# EAGLE design momav_servo (EAGLE 9.6.1)
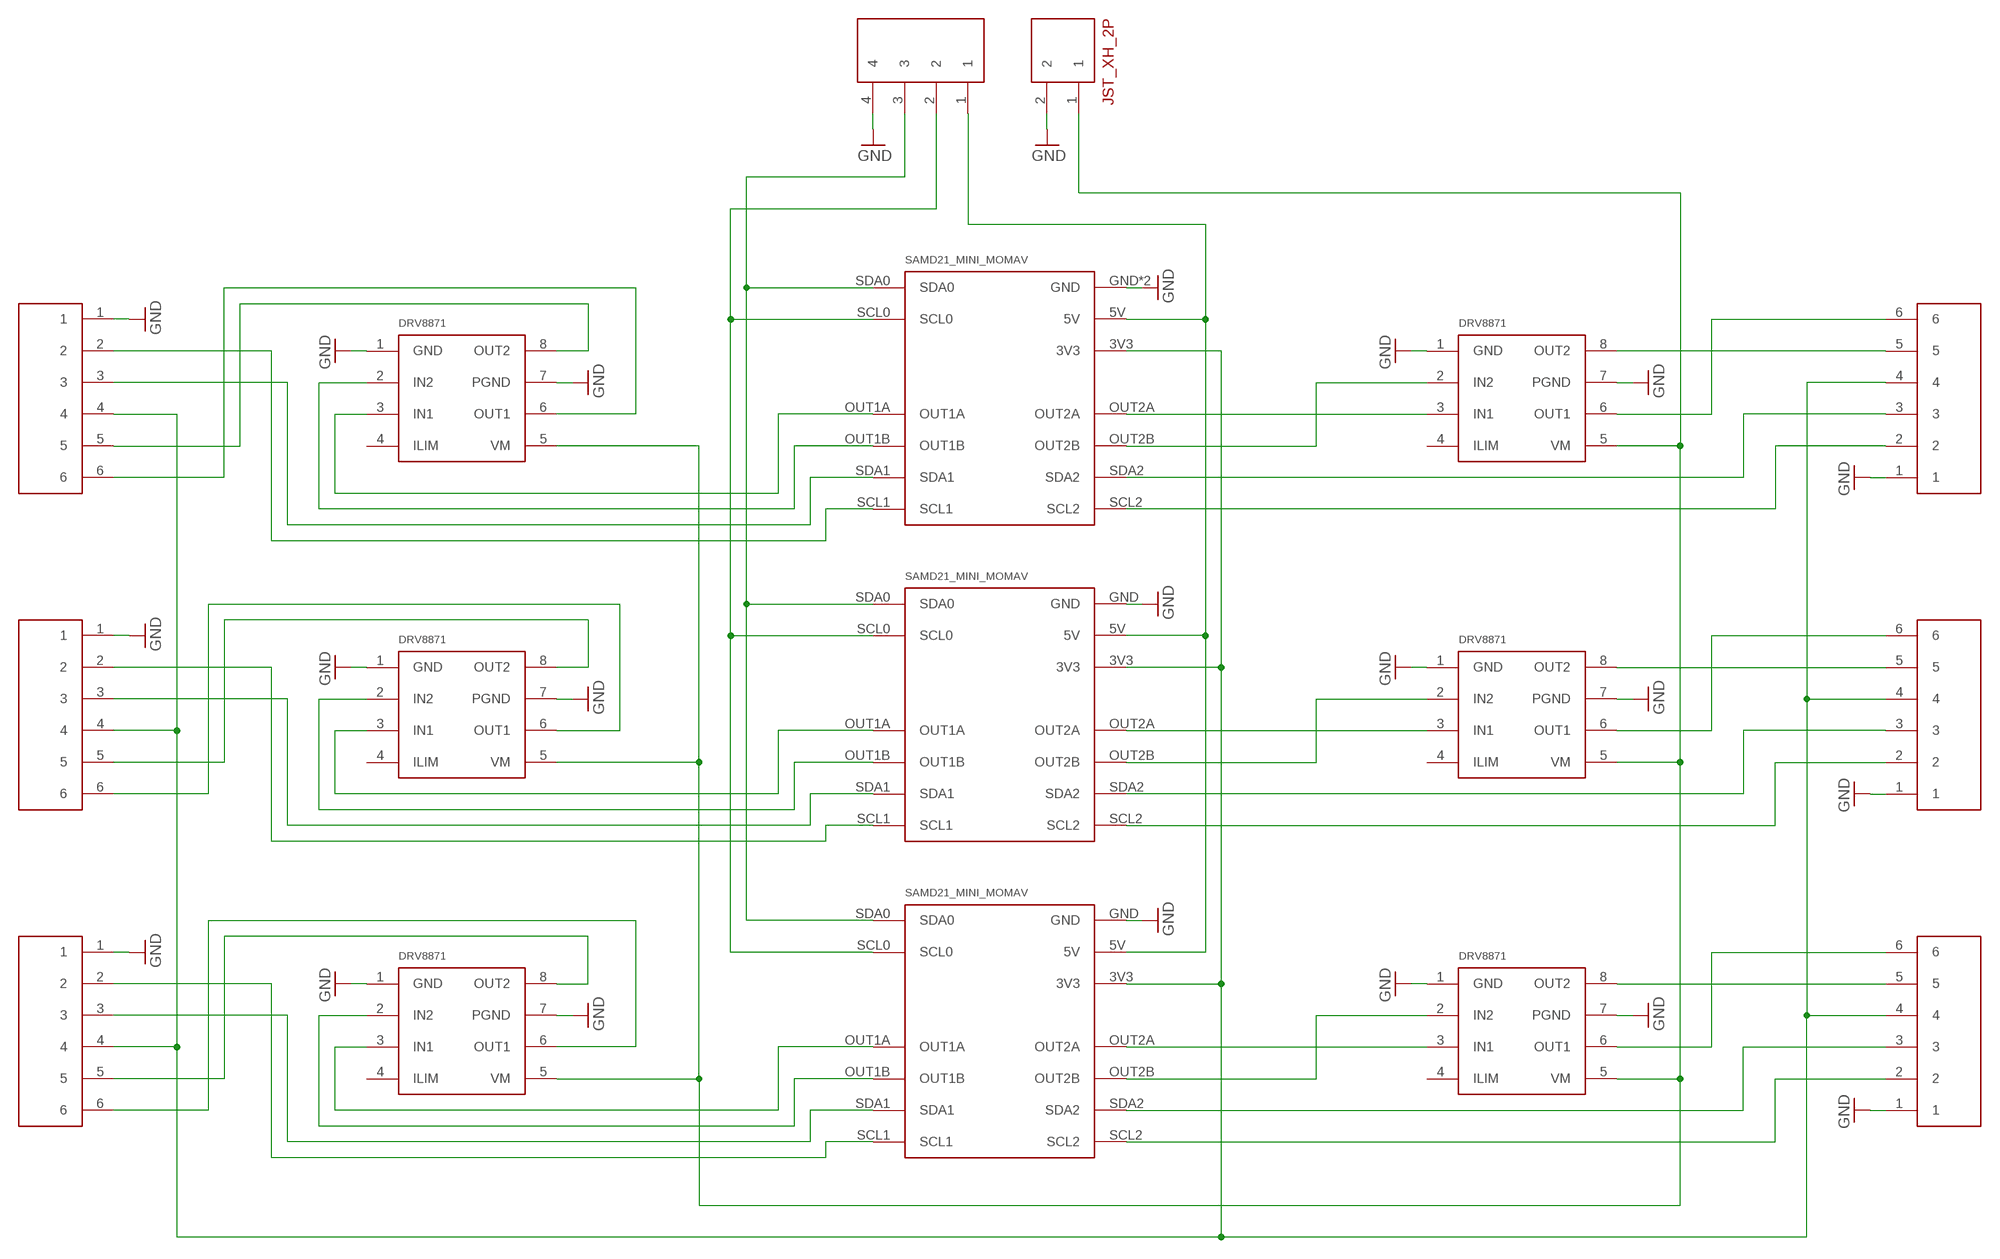
[diagram p0: schematic, sheet 1]

## Parts
U$1  DRV8871BOB  [DRV8871BOB]
U$2  DRV8871BOB  [DRV8871BOB]
U$3  DRV8871BOB  [DRV8871BOB]
U$4  DRV8871BOB  [DRV8871BOB]
U$5  DRV8871BOB  [DRV8871BOB]
U$6  DRV8871BOB  [DRV8871BOB]
U$7  SAMD21_MINI_MOMAV1  [SAMD21_MINI_MOMAV1]
U$8  SAMD21_MINI_MOMAV  [SAMD21_MINI_MOMAV]
U$9  SAMD21_MINI_MOMAV  [SAMD21_MINI_MOMAV]
U$10  JST_XH_2P  [JST_XH_2P]
U$11  JST_ZH_4P  [JST_ZH_4P]
U$12  JST_ZH_6P  [JST_ZH_6P]
U$13  JST_ZH_6P  [JST_ZH_6P]
U$14  JST_ZH_6P  [JST_ZH_6P]
U$15  JST_ZH_6P  [JST_ZH_6P]
U$16  JST_ZH_6P  [JST_ZH_6P]
U$17  JST_ZH_6P  [JST_ZH_6P]

## Nets
GND: U$1.1(GND) U$1.7(PGND) U$2.1(GND) U$2.7(PGND) U$3.1(GND) U$3.7(PGND) U$4.1(GND) U$4.7(PGND) U$5.1(GND) U$5.7(PGND) U$6.1(GND) U$6.7(PGND) U$7.GND U$7.GND2(GND) U$8.GND U$9.GND U$10.2 U$11.4 U$12.1 U$13.1 U$14.1 U$15.1 U$16.1 U$17.1
N$1: U$7.SCL1 U$12.2
N$2: U$1.3(IN1) U$7.OUT1A
N$3: U$1.2(IN2) U$7.OUT1B
N$4: U$2.3(IN1) U$8.OUT1A
N$5: U$2.2(IN2) U$8.OUT1B
N$6: U$3.3(IN1) U$9.OUT1A
N$7: U$3.2(IN2) U$9.OUT1B
N$8: U$4.3(IN1) U$7.OUT2A
N$9: U$7.5V U$8.5V U$9.5V U$11.1
N$10: U$5.3(IN1) U$8.OUT2A
N$11: U$5.2(IN2) U$8.OUT2B
N$12: U$6.3(IN1) U$9.OUT2A
N$13: U$6.2(IN2) U$9.OUT2B
N$14: U$7.SDA0 U$8.SDA0 U$9.SDA0 U$11.3
N$15: U$7.SCL0 U$8.SCL0 U$9.SCL0 U$11.2
N$16: U$4.2(IN2) U$7.OUT2B
N$17: U$9.SCL2 U$15.2
N$18: U$1.5(VM) U$2.5(VM) U$3.5(VM) U$4.5(VM) U$5.5(VM) U$6.5(VM) U$10.1
N$19: U$7.SDA1 U$12.3
N$20: U$8.SDA1 U$13.3
N$21: U$8.SCL1 U$13.2
N$22: U$9.SDA1 U$14.3
N$23: U$9.SCL1 U$14.2
N$24: U$7.3V3 U$8.3V3 U$9.3V3 U$12.4 U$13.4 U$14.4 U$15.4 U$16.4 U$17.4
N$25: U$9.SDA2 U$15.3
N$26: U$8.SCL2 U$16.2
N$27: U$8.SDA2 U$16.3
N$28: U$7.SCL2 U$17.2
N$29: U$7.SDA2 U$17.3
N$30: U$4.6(OUT1) U$17.6
N$31: U$4.8(OUT2) U$17.5
N$32: U$5.8(OUT2) U$16.5
N$33: U$6.6(OUT1) U$15.6
N$34: U$6.8(OUT2) U$15.5
N$36: U$1.8(OUT2) U$12.5
N$37: U$1.6(OUT1) U$12.6
N$38: U$2.8(OUT2) U$13.5
N$39: U$2.6(OUT1) U$13.6
N$40: U$5.6(OUT1) U$16.6
N$41: U$3.6(OUT1) U$14.6
N$42: U$3.8(OUT2) U$14.5
Unconnected: U$1.4(ILIM) U$2.4(ILIM) U$3.4(ILIM) U$4.4(ILIM) U$5.4(ILIM) U$6.4(ILIM)

## Library data of the parts
U$1-U$6 = _custom:DRV8871: DRV8871 H-Bridge Motor driver
U$7 = _custom:SAMD21_MINI_MOMAV1: Sparkfun SAMD21 Mini board for MOMAV project
U$8 U$9 = _custom:SAMD21_MINI_MOMAV: Sparkfun SAMD21 Mini board for MOMAV project
U$10 = _custom:JST_XH_2P
U$11 = _custom:JST_ZH_4P
U$12-U$17 = _custom:JST_ZH_6P

## Board
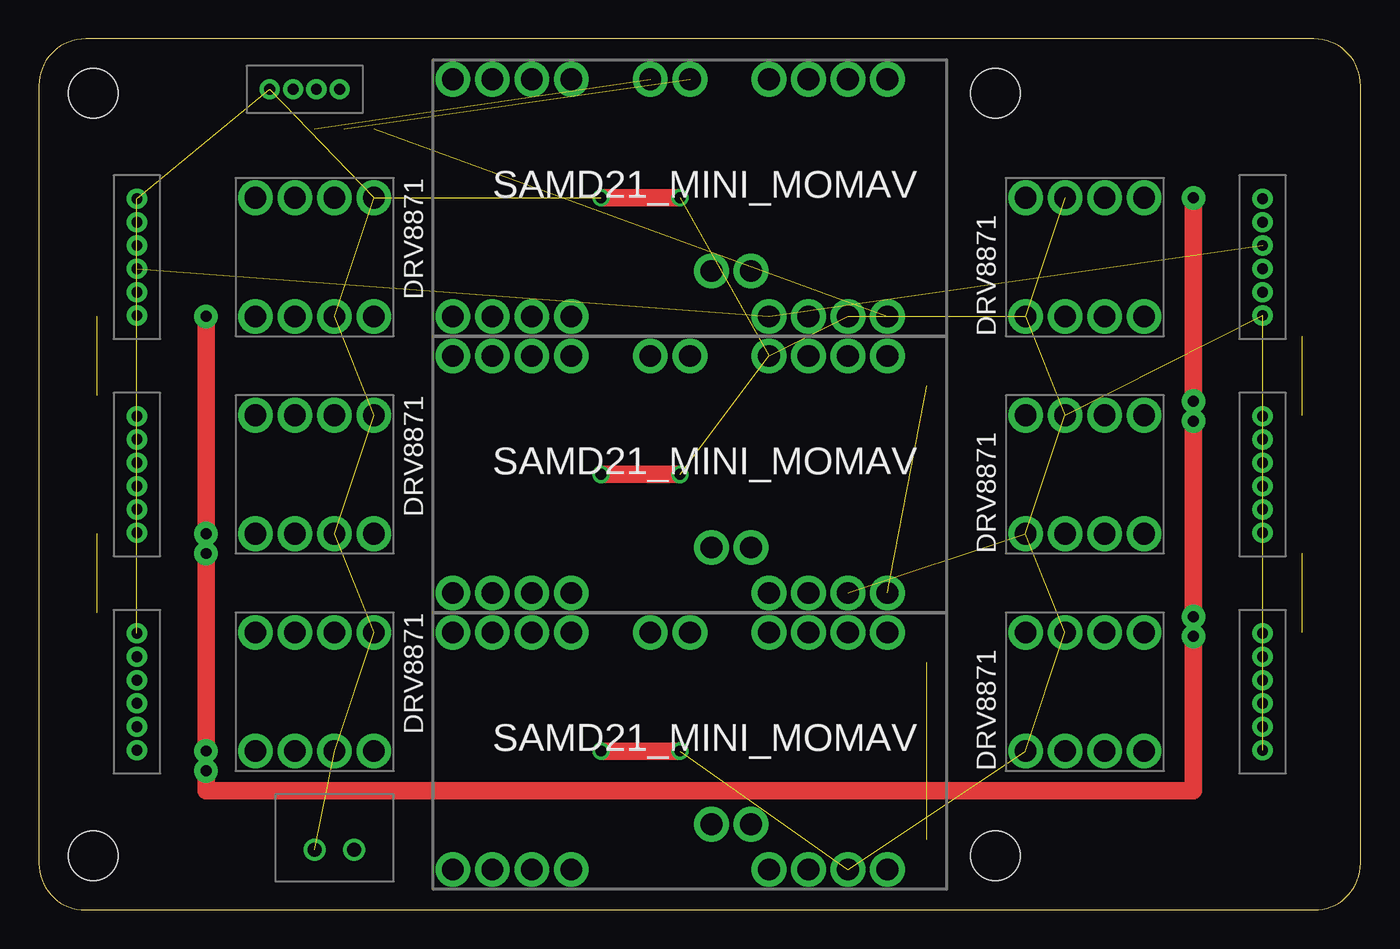
[diagram p1: board, top side]
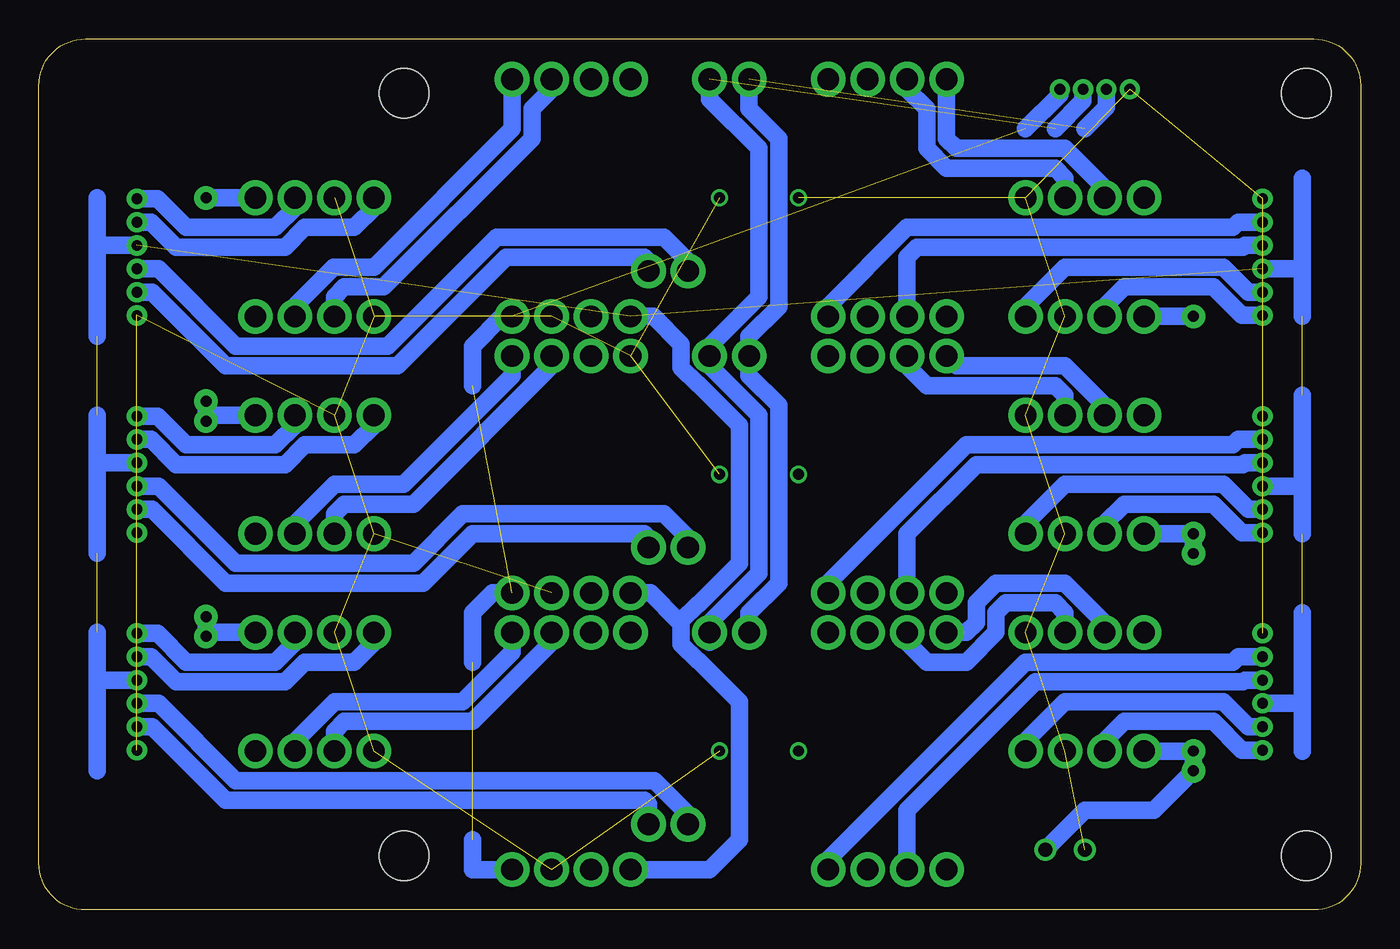
[diagram p2: board, bottom side, seen from below]

Size 85 x 56 mm. Coordinates in mm from the lower left corner, seen from the top.
Outline: 0,53 0,3 arc90 3,0 82,0 arc90 85,3 85,53 arc90 82,56 3,56 arc90 0,53
Copper layers (1*16): Top 0.035mm / dielectric 1.5mm / Bottom 0.035mm
Design rules "default": minimum track width 6mil, minimum drill 0.35mm, track to track 6mil, track to pad 6mil, pad to pad 6mil, via to via 6mil, smd to smd 6mil, copper to edge 40mil, drill to drill 6mil, minimum pad ring 10mil, minimum via ring 8mil, stop-mask expansion 4mil, vias tented up to drill 0mil, thermal gap 10mil
Holes 3.17 mm at 3.5,52.5 61.5,52.5 61.5,3.5 3.5,3.5

### Footprints (pad centres in the part's own frame; a part is rotated, then mirrored left to right if it is on the bottom)
DRV8871BOB = drill 1.4 pad 2.235: 1 -3.81,3.81; 2 -3.81,1.27; 3 -3.81,-1.27; 4 -3.81,-3.81; 5 3.81,-3.81; 6 3.81,-1.27; 7 3.81,1.27; 8 3.81,3.81
SAMD21_MINI_MOMAV1 = drill 1.4 pad 2.235: 3V3 5.08,-7.62; 5V 12.7,-7.62; GND 10.16,-7.62; GND2 5.08,7.62; NC1 -10.16,7.62; NC2 -7.62,7.62; NC3 -15.24,-7.62; NC4 -10.16,-7.62; NC6 7.62,7.62; NC7 7.62,-7.62; OUT1A 12.7,7.62; OUT1B 10.16,7.62; OUT2A -15.24,7.62; OUT2B -12.7,7.62; SCL0 0,7.62; SCL1 3.937,-4.699; SCL2 -7.62,-7.62; SDA0 -2.54,7.62; SDA1 1.397,-4.699; SDA2 -12.7,-7.62
SAMD21_MINI_MOMAV = drill 1.4 pad 2.235: 3V3 5.08,-7.62; 5V 12.7,-7.62; GND 10.16,-7.62; NC1 -10.16,7.62; NC2 -7.62,7.62; NC3 -15.24,-7.62; NC4 -10.16,-7.62; NC5 5.08,7.62; NC6 7.62,7.62; NC7 7.62,-7.62; OUT1A 12.7,7.62; OUT1B 10.16,7.62; OUT2A -15.24,7.62; OUT2B -12.7,7.62; SCL0 0,7.62; SCL1 3.937,-4.699; SCL2 -7.62,-7.62; SDA0 -2.54,7.62; SDA1 1.397,-4.699; SDA2 -12.7,-7.62
JST_XH_2P = drill 0.9: 1 -1.27,0; 2 1.27,0
JST_ZH_4P = drill 0.7 pad 1.295: 1 -2.25,0; 2 -0.75,0; 3 0.75,0; 4 2.25,0
JST_ZH_6P = drill 0.7 pad 1.295: 1 -3.75,0; 2 -2.25,0; 3 -0.75,0; 4 0.75,0; 5 2.25,0; 6 3.75,0

### Placement (x,y rotation side)
U$1  67.26,28 90 top
U$2  67.26,14.03 90 top
U$3  67.26,41.97 90 top
U$4  17.73,28 270 top
U$5  17.73,14.03 270 top
U$6  17.73,41.97 270 top
U$7  41.86,28 0 top
U$8  41.86,10.22 0 top
U$9  41.86,45.78 0 top
U$10  19,3.87 180 top
U$11  17.1,52.76 180 top
U$12  78.69,28 90 top
U$13  78.69,14.03 90 top
U$14  78.69,41.97 90 top
U$15  6.3,41.97 270 top
U$16  6.3,14.03 270 top
U$17  6.3,28 270 top

### Tracks (layer width: path | path; a pad name or v marks a point on that pad's centre or on a via)
GND  (via drill 0.7)  (26 unrouted)
  Top 1.118: v36.15,45.78 v41.23,45.78 | v36.15,28 v41.23,28 | v36.15,10.22 v41.23,10.22
N$1
  Bottom 1.118: U$7.SCL1 45.8,23.94 46.06,24.19 57.1,24.19 60.28,21.01 72.98,21.01 77.71,25.75 U$12.2
N$2
  Bottom 1.118: U$1.3 68.53,24.82 65.99,27.36 61.55,27.36 54.56,34.35 U$7.OUT1A
N$3
  Bottom 1.118: U$1.2 65.99,25.46 65.36,26.09 60.91,26.09 52.02,34.98 U$7.OUT1B
N$4
  Bottom 1.118: U$2.3 68.53,10.85 65.99,13.39 57.74,13.39 54.56,16.57 U$8.OUT1A
N$5
  Bottom 1.118: U$2.2 65.99,11.49 65.36,12.12 57.1,12.12 52.02,17.2 U$8.OUT1B
N$6
  Bottom 1.118: U$3.3 68.53,38.86 66.06,41.33 63.45,41.33 54.56,50.22 U$9.OUT1A
N$7
  Bottom 1.118: U$3.2 65.99,39.43 65.36,40.06 62.82,40.06 53.29,49.59 53.29,51.49 52.02,52.76 U$9.OUT1B
N$8
  Bottom 1.118: U$7.OUT2A 25.99,34.98 19,34.98 16.46,32.44 U$4.3
N$9  (3 unrouted)
  Bottom 1.118: U$8.5V 57.1,2.6 57.1,4.5 | U$9.5V 55.2,38.16 57.1,36.25 57.1,33.71 | U$7.5V 55.83,20.38 57.1,19.11 57.1,15.93 | U$11.1 19.35,52.42 21.54,50.22
N$10
  Bottom 1.118: U$8.OUT2A 25.35,17.84 24.72,18.47 24.72,19.74 23.45,21.01 19,21.01 16.46,18.47 U$5.3
N$11
  Bottom 1.118: U$5.2 19,19.11 19.64,19.74 22.81,19.74 23.45,19.11 23.45,17.84 25.35,15.93 27.89,15.93 29.16,17.2 U$8.OUT2B
N$12
  Bottom 1.118: U$6.3 16.46,46.41 19,48.95 25.99,48.95 26.62,49.59 U$9.OUT2A
N$13
  Bottom 1.118: U$6.2 19,47.05 19.64,47.68 26.62,47.68 27.89,48.95 27.89,51.49 29.16,52.76 U$9.OUT2B
N$14  (1 unrouted)
  Bottom 1.118: U$8.SDA0 39.32,19.11 37.42,21.01 37.42,32.44 39.32,34.35 U$7.SDA0 39.32,36.89 37.42,38.79 37.42,49.59 39.32,51.49 U$9.SDA0 | U$11.3 16.35,51.61 17.73,50.22
N$15  (1 unrouted)
  Bottom 1.118: U$9.SCL0 41.86,52.13 38.69,48.95 38.69,39.43 41.86,36.25 U$7.SCL0 41.86,34.98 38.69,31.81 38.69,21.65 41.86,18.47 U$8.SCL0 41.86,17.2 | U$11.2 17.85,52.01 19.64,50.22
N$16
  Bottom 1.118: U$7.OUT2B 29.16,34.98 27.89,33.71 19.64,33.71 19,33.08 U$4.2
N$17
  Bottom 1.118: U$9.SCL2 34.24,38.79 29.16,43.87 8.21,43.87 7.86,44.22 U$15.2
N$18  (via drill 0.7 pad 1.52)
  Top 1.118: v74.25,18.86 v74.25,31.43 | v74.25,45.78 v74.25,32.7 | v10.75,10.22 v10.75,22.92 | v10.75,24.19 v10.75,38.16 | v10.75,8.95 10.75,7.68 74.25,7.68 v74.25,17.59
  Bottom 1.118: U$2.5 74,17.84 v74.25,17.59 v74.25,18.86 | U$5.5 v10.75,10.22 v10.75,8.95 13.29,6.41 17.73,6.41 U$10.1 | v74.25,32.7 v74.25,31.43 73.87,31.81 U$1.5 | v10.75,22.92 v10.75,24.19 U$4.5 | U$3.5 v74.25,45.78 | U$6.5 v10.75,38.16
N$19
  Bottom 1.118: U$7.SDA1 43.26,23.94 44.79,25.46 57.74,25.46 60.91,22.28 72.34,22.28 77.31,27.25 U$12.3
N$20
  Bottom 1.118: U$13.3 77.31,13.28 72.34,8.31 45.42,8.31 43.26,6.16 U$8.SDA1
N$21
  Bottom 1.118: U$8.SCL1 45.8,6.79 46.06,7.04 72.98,7.04 77.71,11.78 U$13.2
N$22
  Bottom 1.118: U$9.SDA1 43.26,41.72 44.79,43.24 55.58,43.24 62.57,36.25 72.34,36.25 77.31,41.22 U$14.3
N$23
  Bottom 1.118: U$9.SCL1 45.8,41.72 46.06,41.97 54.95,41.97 61.93,34.98 72.98,34.98 77.71,39.72 U$14.2
N$24  (6 unrouted)
  Bottom 1.118: U$8.3V3 41.86,2.6 39.96,4.5 39.96,13.39 42.58,16.01 42.62,16.01 43.69,17.08 43.69,18.6 | U$9.3V3 45.48,38.16 43.69,36.38 43.69,34.86 42.62,33.79 42.58,33.79 39.96,31.17 39.96,22.28 42.58,19.67 42.62,19.67 43.69,18.6 | 43.69,18.6 43.89,18.6 45.67,20.38 U$7.3V3 | U$12.4 81.23,28.75 | 81.23,28.75 81.23,22.92 | 81.23,31.81 81.23,28.75 | 81.23,36.89 81.23,42.72 | U$14.4 81.23,42.72 | 81.23,42.72 81.23,45.78 | U$13.4 81.23,14.78 | 81.23,14.78 81.23,17.84 | 81.23,14.78 81.23,8.95 | U$15.4 3.76,41.22 | 3.76,41.22 3.76,47.05 | 3.76,41.22 3.76,38.16 | U$17.4 3.76,27.25 | 3.76,27.25 3.76,33.08 | 3.76,27.25 3.76,24.19 | U$16.4 3.76,13.28 | 3.76,13.28 3.76,19.11 | 3.76,13.28 3.76,10.22
N$25
  Bottom 1.118: U$9.SDA2 29.16,41.97 28.53,42.6 7.57,42.6 7.46,42.72 U$15.3
N$26
  Bottom 1.118: U$16.2 7.86,16.28 8.21,15.93 21.54,15.93 34.24,3.23 U$8.SCL2
N$27
  Bottom 1.118: U$16.3 7.46,14.78 7.57,14.66 20.91,14.66 29.16,6.41 U$8.SDA2
N$28
  Bottom 1.118: U$17.2 7.86,30.25 8.21,29.9 25.35,29.9 34.24,21.01 U$7.SCL2
N$29
  Bottom 1.118: U$17.3 7.46,28.75 7.57,28.63 24.72,28.63 29.16,24.19 U$7.SDA2
N$30
  Bottom 1.118: U$4.6 16.46,24.82 15.19,26.09 9.48,26.09 7.63,24.25 U$17.6
N$31
  Bottom 1.118: U$4.8 21.54,24.82 19,27.36 8.84,27.36 7.23,25.75 U$17.5
N$32
  Bottom 1.118: U$5.8 21.54,10.85 19,13.39 8.84,13.39 7.23,11.78 U$16.5
N$33
  Bottom 1.118: U$6.6 16.46,38.79 15.19,40.06 9.48,40.06 7.63,38.22 U$15.6
N$34
  Bottom 1.118: U$6.8 21.54,38.79 19,41.33 8.84,41.33 7.23,39.72 U$15.5
N$36
  Bottom 1.118: U$1.8 63.45,31.17 64.72,29.9 67.9,29.9 69.17,28.63 76.15,28.63 77.77,30.25 U$12.5
N$37
  Bottom 1.118: U$1.6 68.53,31.17 69.8,29.9 75.52,29.9 77.36,31.75 U$12.6
N$38
  Bottom 1.118: U$2.8 63.45,17.2 64.72,15.93 67.9,15.93 69.17,14.66 76.15,14.66 77.77,16.28 U$13.5
N$39
  Bottom 1.118: U$2.6 68.53,17.2 69.8,15.93 75.52,15.93 77.36,17.78 U$13.6
N$40
  Bottom 1.118: U$5.6 16.46,10.85 15.19,12.12 9.48,12.12 7.63,10.28 U$16.6
N$41
  Bottom 1.118: U$3.6 68.53,45.14 69.8,43.87 75.52,43.87 77.36,45.72 U$14.6
N$42
  Bottom 1.118: U$14.5 77.77,44.22 76.15,42.6 69.17,42.6 67.9,43.87 64.72,43.87 63.45,45.14 U$3.8